# EAGLE design piezo_preamp_alex_rice_nodiodes (EAGLE 5.09)
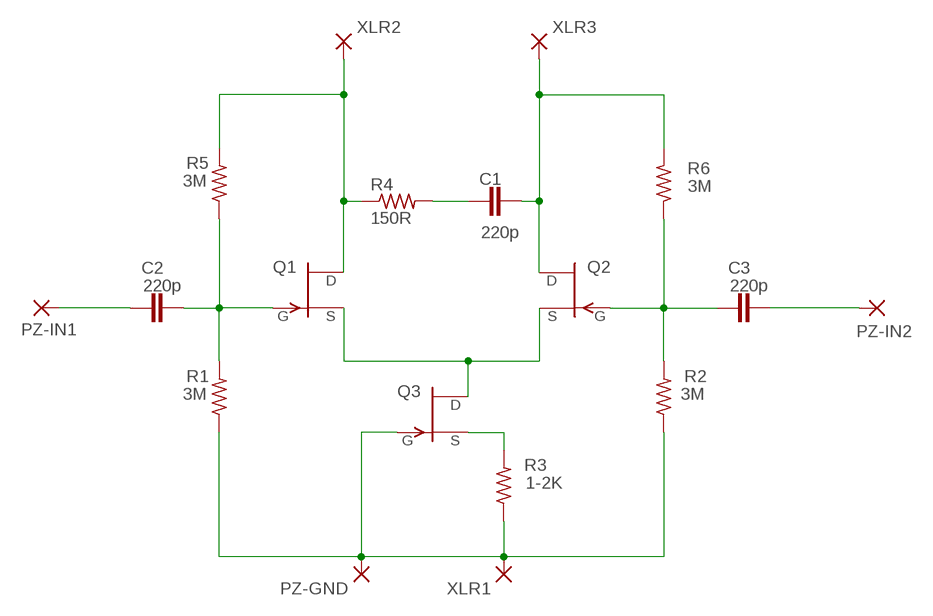
[diagram p0: schematic, sheet 1]

## Parts
C1  220p  C-EU050-030X075  [C050-030X075]
C2  220p  C-EU050-030X075  [C050-030X075]
C3  220p  C-EU050-030X075  [C050-030X075]
PZ-GND  3,81/1,1  [3,81/1,1]
PZ-IN1  3,81/1,1  [3,81/1,1]
PZ-IN2  3,81/1,1  [3,81/1,1]
Q1  2N3819  2N3819-WIDETO92_WIDE  [TO92]
Q2  2N3819-WIDETO92_WIDE  [TO92]
Q3  2N3819-WIDETO92_WIDE  [TO92]
R1  3M  R-US_0414/5V  [0414V]
R2  3M  R-US_0414/5V  [0414V]
R3  1-2K  R-US_0414/5V  [0414V]
R4  150R  R-US_0414/5V  [0414V]
R5  3M  R-US_0414/5V  [0414V]
R6  3M  R-US_0414/5V  [0414V]
XLR1  3,81/1,1  [3,81/1,1]
XLR2  3,81/1,1  [3,81/1,1]
XLR3  3,81/1,1  [3,81/1,1]

## Nets
GND: PZ-GND.1(P) Q3.2(G) R1.1 R2.1 R3.1 XLR1.1(P)
N$1: Q1.1(D) R4.1 R5.2 XLR2.1(P)
N$2: C1.2 Q2.1(D) R6.2 XLR3.1(P)
N$3: C1.1 R4.2
N$4: C3.1 Q2.2(G) R2.2 R6.1
N$5: C2.2 Q1.2(G) R1.2 R5.1
N$8: Q3.3(S) R3.2
N$10: C2.1 PZ-IN1.1(P)
N$11: Q1.3(S) Q2.3(S) Q3.1(D)
N$12: C3.2 PZ-IN2.1(P)

## Library data of the parts
C1-C3 = rcl:C-EU: CAPACITOR, European symbol
PZ-GND PZ-IN1 PZ-IN2 XLR1-XLR3 = wirepad:3,81/1,1: THROUGH-HOLE PAD
Q1-Q3 = T092_wide:2N3819-WIDE: N-Channel Junction FET
R1-R3 R5 R6 = rcl:R-US_: RESISTOR, American symbol
R4 = resistor:R-US_: RESISTOR, American symbol

## Board
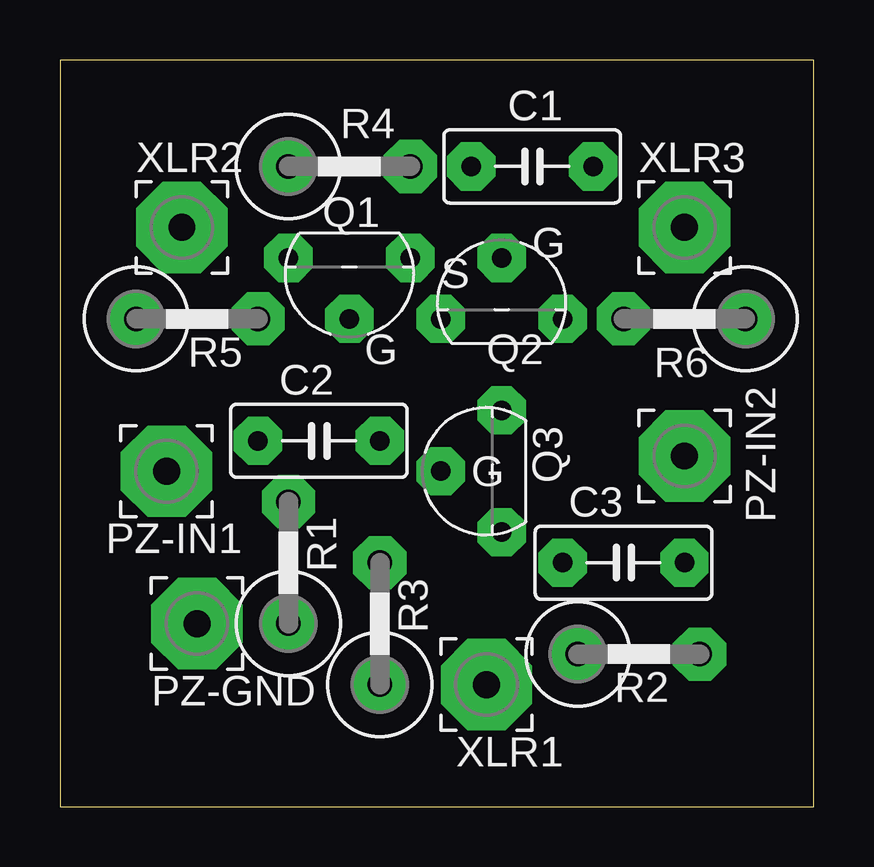
[diagram p1: board, top side]
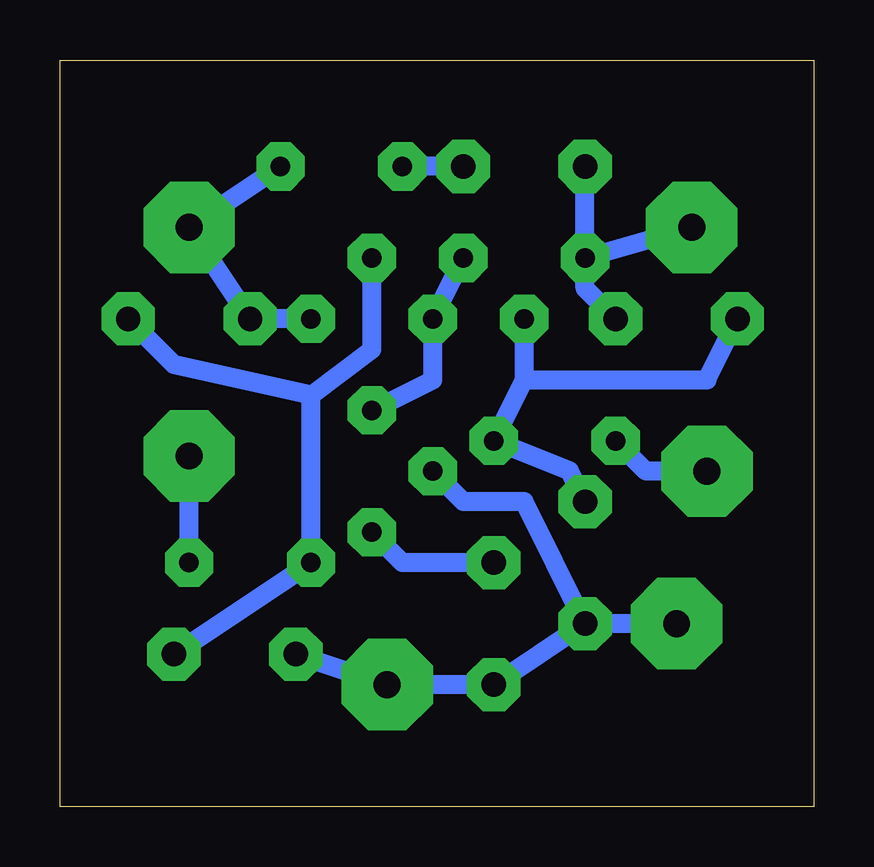
[diagram p2: board, bottom side, seen from below]

Size 31.42 x 31.11 mm. Coordinates in mm from the lower left corner, seen from the top.
Outline: 0,0 31.42,0 31.42,31.11 0,31.11 0,0
Copper layers (1*16): Top 0.035mm / dielectric 1.5mm / Bottom 0.035mm
Design rules "hobby": minimum track width 0.8mm, minimum drill 0.8mm, track to track 0.8mm, track to pad 0.8mm, pad to pad 0.45mm, via to via 0.8mm, smd to smd 8mil, copper to edge 10mil, drill to drill 8mil, minimum pad ring 0.6mm, minimum via ring 0.6mm, stop-mask expansion 0mil, vias tented up to drill 0mil, thermal gap 10mil

### Footprints (pad centres in the part's own frame; a part is rotated, then mirrored left to right if it is on the bottom)
C050-030X075 = drill 0.813 octagon: 1 -2.54,0; 2 2.54,0
3,81/1,1 = drill 1.118 pad 3.81 octagon: 1 0,0
TO92 = drill 0.813 octagon: 1 2.54,-0.635; 2 0,1.905; 3 -2.54,-0.635
0414V = drill 1.016 octagon: 1 -2.54,0; 2 2.54,0

### Placement (x,y rotation side)
C1  19.68,26.67 0 top
C2  10.8,15.24 0 top
C3  23.5,10.16 0 top
PZ-GND  5.71,7.62 0 top
PZ-IN1  4.45,13.97 0 top
PZ-IN2  26.04,14.61 0 top
Q1  12.07,22.23 180 top
Q2  18.42,20.95 0 top
Q3  17.78,13.97 90 top
R1  9.53,10.16 90 top
R2  24.13,6.35 0 top
R3  13.34,7.62 90 top
R4  12.07,26.67 0 top
R5  5.71,20.32 0 top
R6  26.04,20.32 180 top
XLR1  17.78,5.08 0 top
XLR2  5.08,24.13 0 top
XLR3  26.04,24.13 0 top

### Tracks (layer width: path | path; a pad name or v marks a point on that pad's centre or on a via)
GND
  Bottom 0.8: R1.1 R3.1 XLR1.1 | PZ-GND.1 R1.1 | XLR1.1 R2.1 XLR1.1 | Q3.2 14.61,12.7 12.07,12.7 R1.1
N$1
  Bottom 0.8: Q1.1 XLR2.1 | Q1.1 R4.1 | Q1.1 9.53,21.59 R5.2
N$2
  Bottom 0.8: C1.2 XLR3.1 R6.2 Q2.1
N$3
  Bottom 0.8: R4.2 C1.1
N$4
  Bottom 0.8: R2.2 C3.1 20.96,17.15 | 20.96,17.15 18.42,19.05 Q2.2 | 20.96,17.15 26.67,18.41 R6.1
N$5
  Bottom 0.8: 12.07,17.78 C2.2 10.16,13.97 R1.2 | R5.1 4.45,17.78 12.07,17.78 | 12.07,17.78 Q1.2
N$8
  Bottom 0.8: Q3.3 17.14,10.16 R3.2
N$10
  Bottom 0.8: C2.1 6.99,13.97 PZ-IN1.1
N$11
  Bottom 0.8: Q1.3 Q2.3 15.88,17.78 Q3.1
N$12
  Bottom 0.8: C3.2 PZ-IN2.1

### Text on the board
tNames: G | S | G | G